# EAGLE design tiny85 (EAGLE 7.1.0)
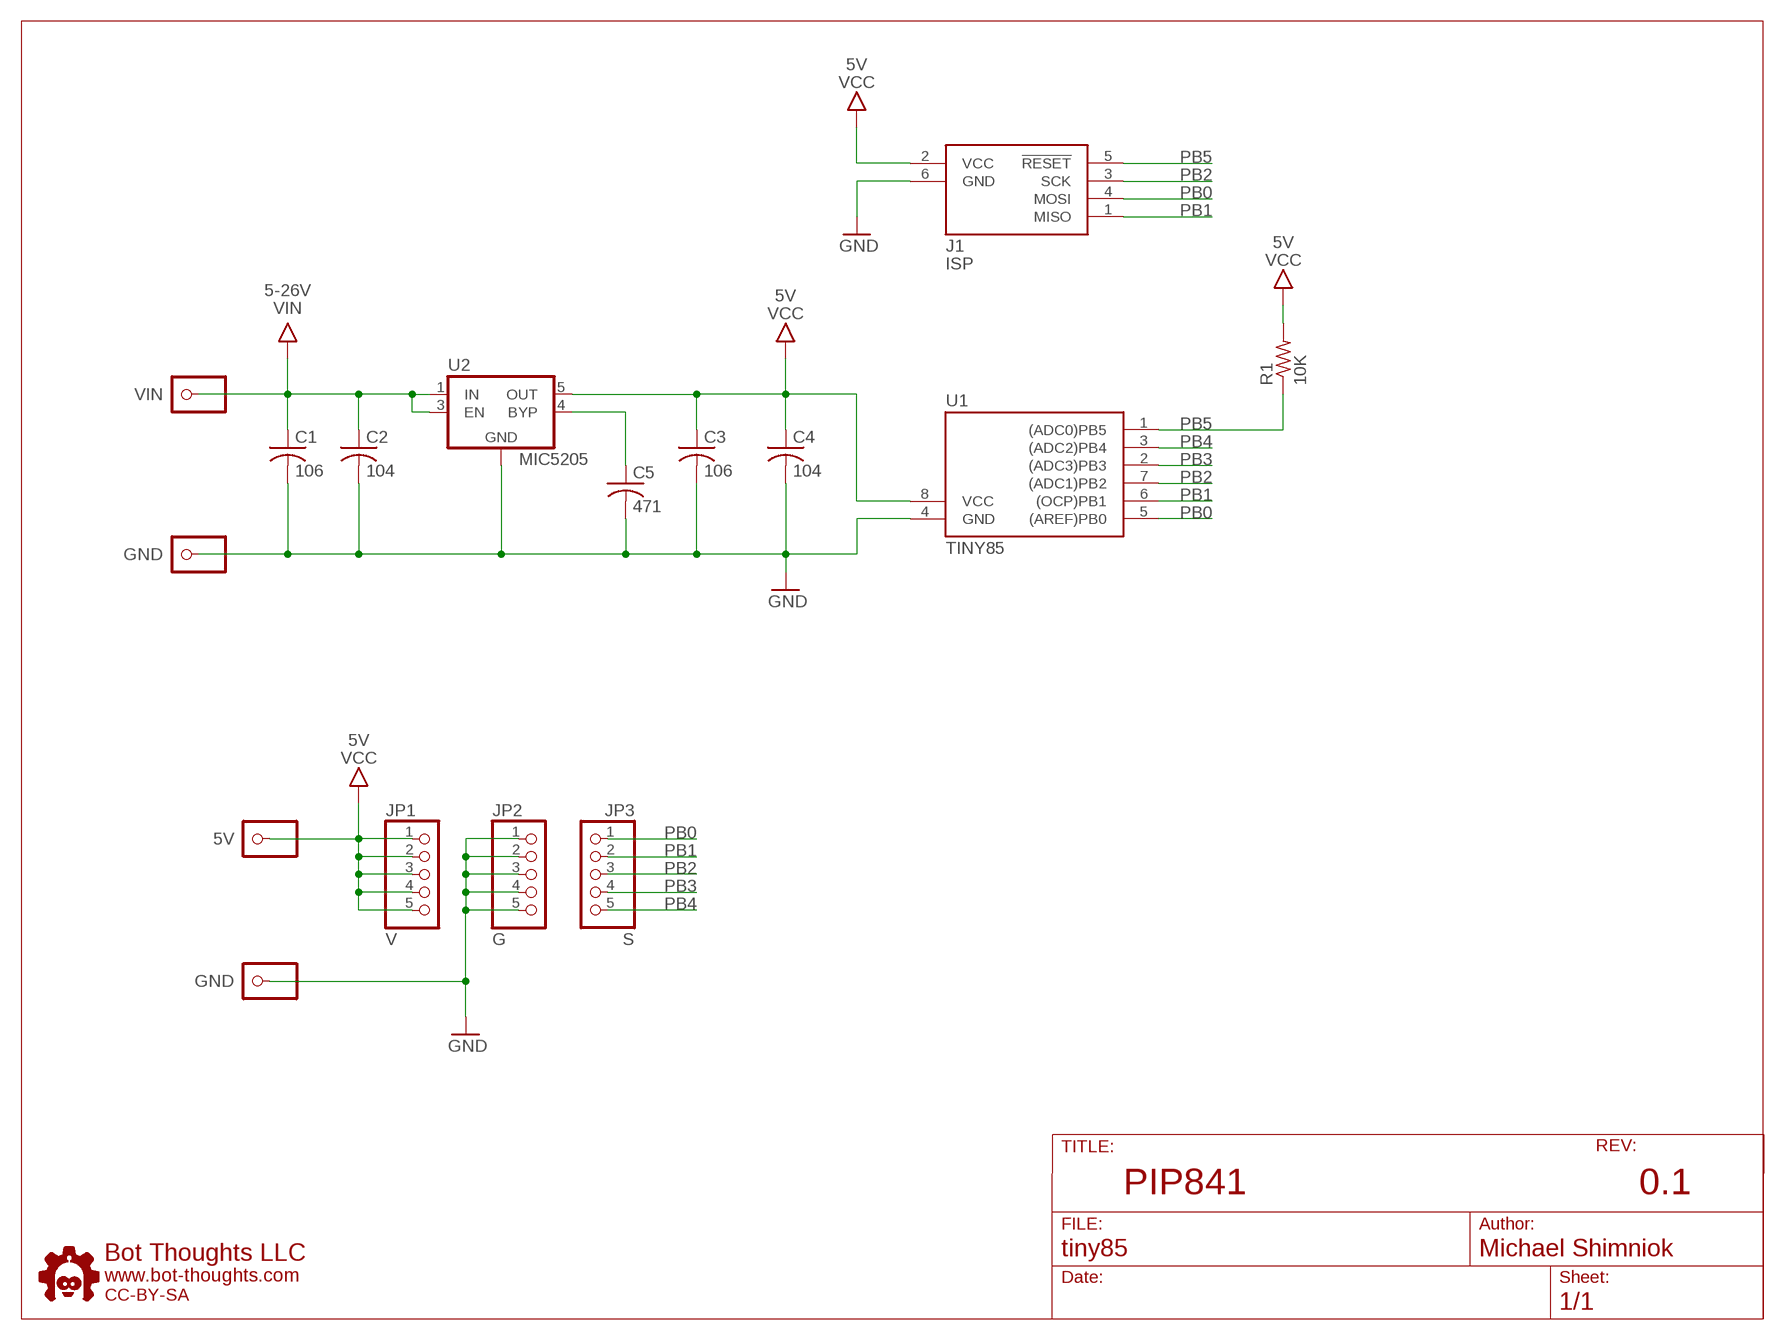
[diagram p0: schematic, sheet 1]

## Parts
C1  106  C-1206  [1206]
C2  104  C-0603  [0603]
C3  106  C-1206  [1206]
C4  104  C-0603  [0603]
C5  471  C-0603  [0603]
J1  ISP  AVRISP6_COMPACT  [CON6P2R]
JP1  V  PINHD-1X05_2.54-S  [1X05-S]
JP2  G  PINHD-1X05_2.54-S  [1X05-S]
JP3  S  PINHD-1X05_2.54-S  [1X05-S]
JP4  GND  PINHD-1X01_2.54  [1X01]
JP5  VIN  PINHD-1X01_2.54  [1X01]
JP6  GND  PINHD-1X01_2.54  [1X01]
JP8  5V  PINHD-1X01_2.54  [1X01]
R1  10K  R0603  [0603]
U1  TINY85  TINY25/45/85-20SU  [SOIC8]
U2  MIC5205  [SOT23-5]
U$3  BTLOGO-LOGO-MD  [BTLOGOM]

## Nets
GND: C1.2(-) C2.2(-) C3.2(-) C4.2(-) C5.2(-) J1.6(GND) JP2.1 JP2.2 JP2.3 JP2.4 JP2.5 JP4.1 JP6.1 U1.4(GND) U2.2(GND)
N$3: C5.1(+) U2.4(BYP)
PB0: J1.4(MOSI) JP3.1 U1.5((AREF)PB0)
PB1: J1.1(MISO) JP3.2 U1.6((OCP)PB1)
PB2: J1.3(SCK) JP3.3 U1.7((ADC1)PB2)
PB3: JP3.4 U1.2((ADC3)PB3)
PB4: JP3.5 U1.3((ADC2)PB4)
PB5: J1.5(!RESET) R1.1 U1.1((ADC0)PB5)
VCC: C3.1(+) C4.1(+) J1.2(VCC) JP1.1 JP1.2 JP1.3 JP1.4 JP1.5 JP8.1 R1.2 U1.8(VCC) U2.5(OUT) ; supply symbol labelled 5V
VIN: C1.1(+) C2.1(+) JP5.1 U2.1(IN) U2.3(EN) ; supply symbol labelled 5-26V

## Notes on the sheet
- PIP841 | 0.1

## Library data of the parts
C1-C5 = bt_rcl:C: Capacitor, non-polarized, American symbol
J1 = bt_avr:AVRISP6: 6-pin dual-row connector for Atmel AVRISP programmer interface
JP1-JP3 = pinhead-2:PINHD-1X05: PIN HEADER
JP4-JP6 JP8 = bt_electromech:PINHD-1X01: PIN HEADER Generic pin header in a variety of footprints
R1 = bt_rcl:R: Resistor, American symbol
U1 = avr-7:TINY25/45/85
U2 = bt_regulator:MIC5205: ULDO Voltage regulator Voltage input: 2.5-16V Guaranteed 150mA output Low dropout voltage: < 350mV @ 150mA, < 70mV @ 50mA High output voltage accuracy (1%) Ultra-low-noise output Low quiescent current Reverse-battery protection “Zero” off-mode current Logic-controlled electronic enable The MIC5205 is an efficient linear voltage regulator with ultra low-noise output, very low dropout voltage (typically 17mV at light loads and 165mV at 150mA), and very low ground current (600⎧A at 100mA output). The MIC5205 offers better than 1% initial accuracy. Designed especially for hand-held, battery-powered devices, the MIC5205 includes a CMOS or TTL compatible enable/shutdown control input. When shut down, power consumption drops nearly to zero. Regulator ground current increases only slightly in dropout, further prolonging battery life. Key MIC5205 features include a reference bypass pin to improve its already excellent low-noise performance, reversed-battery protection, current limiting, and overtemperature shutdown. datasheet.pdf <http://www.micrel.com/_PDF/mic5205.pdf>
U$3 = bt:BTLOGO: Bot Thoughts Logo

## Board
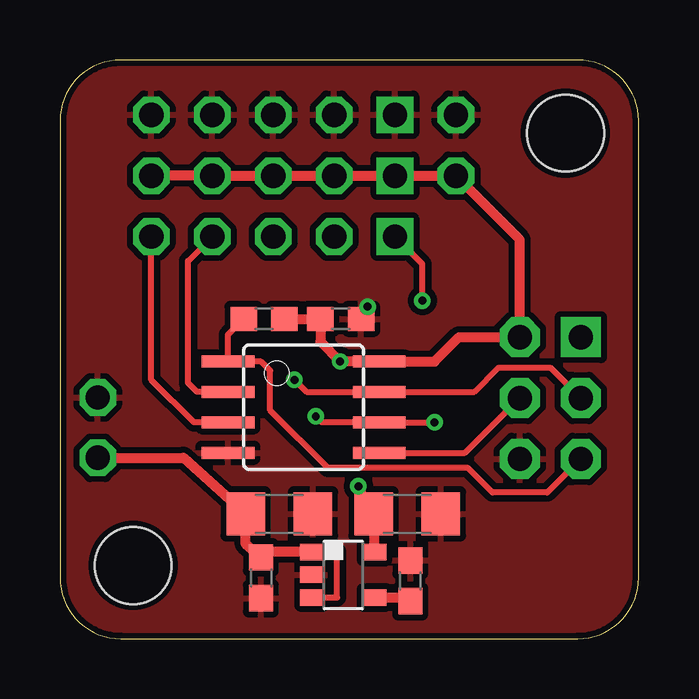
[diagram p1: board, top side]
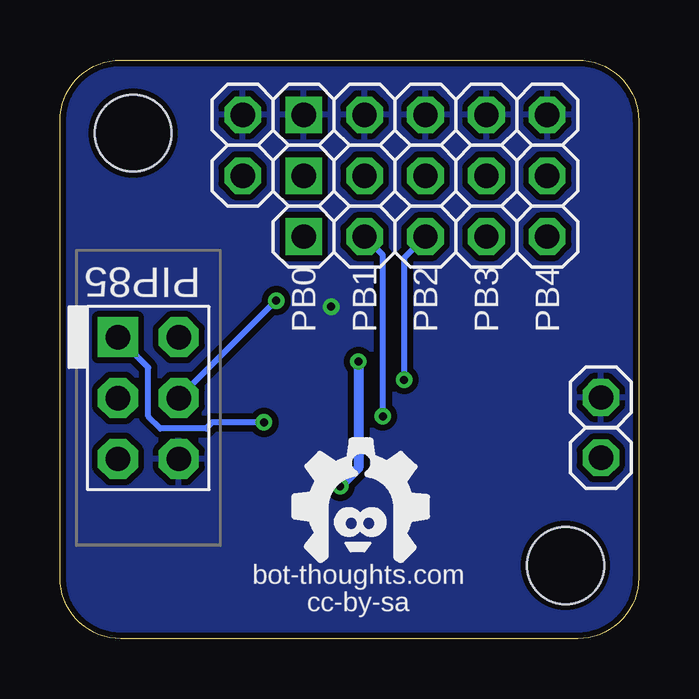
[diagram p2: board, bottom side, seen from below]

Size 24.13 x 24.13 mm. Coordinates in mm from the lower left corner, seen from the top.
Outline: 21.59,24.13 2.54,24.13 arc90 0,21.59 0,2.54 arc90 2.54,0 21.59,0 arc90 24.13,2.54 24.13,21.59 arc90 21.59,24.13
Copper layers (1*16): Top 0.0356mm / dielectric 1.5011mm / Bottom 0.0356mm
Design rules "LaenPCBOrder *": minimum track width 6mil, minimum drill 13mil, track to track 8mil, track to pad 8mil, pad to pad 8mil, via to via 8mil, smd to smd 8mil, copper to edge 10mil, drill to drill 10mil, minimum pad ring 7mil, minimum via ring 7mil, stop-mask expansion 3mil, vias tented up to drill 20mil, thermal gap 10mil
Holes 3.2 mm at 3.05,3.05 21.08,21.08

### Footprints (pad centres in the part's own frame; a part is rotated, then mirrored left to right if it is on the bottom)
1206 = smd 1.6 x 1.8: 1 -1.4,0; 2 1.4,0
0603 = smd 1.1 x 1: 1 -0.85,0; 2 0.85,0
CON6P2R = drill 1.016 pad 1.676 square: 1 -2.54,-1.27 | drill 1.016 pad 1.676 octagon: 2 -2.54,1.27; 3 0,-1.27; 4 0,1.27; 5 2.54,-1.27; 6 2.54,1.27
1X05-S = drill 1.016 square: 1 -5.08,0 | drill 1.016 octagon: 2 -2.54,0; 3 0,0; 4 2.54,0; 5 5.08,0
1X01 = drill 1.016 octagon: 1 0,0
SOIC8 = smd 0.5 x 2.2: 1 -1.905,-3.154; 2 -0.635,-3.154; 3 0.635,-3.154; 4 1.905,-3.154; 5 1.905,3.154; 6 0.635,3.154; 7 -0.635,3.154; 8 -1.905,3.154
SOT23-5 = smd 0.69 x 0.99: 1 -0.95,-1.3; 2 0,-1.3; 3 0.95,-1.3; 4 0.95,1.3; 5 -0.95,1.3

### Placement (x,y rotation side)
C1  9.14,5.21 0 top
C2  8.38,2.54 270 top
C3  14.48,5.21 0 top
C4  11.71,13.34 0 top
C5  14.61,2.41 90 top
J1  20.45,10.03 270 bottom
JP1  8.89,19.3 0 bottom
JP2  8.89,21.84 0 bottom
JP3  8.89,16.76 0 bottom
JP4  16.51,21.84 180 bottom
JP5  1.57,7.54 180 bottom
JP6  1.57,10.06 180 bottom
JP8  16.51,19.3 180 bottom
R1  8.51,13.34 0 top
U1  10.16,9.65 270 top
U2  11.81,2.67 270 top
U$3  11.67,3 0 bottom

### Tracks (layer width: path | path; a pad name or v marks a point on that pad's centre or on a via)
GND  (via drill 0.33)
  other vias: 12.83,13.84
  pour Bottom (isolate 0.254): 24.13,21.59 24.13,2.54 arc-90 21.59,0 2.54,0 arc-90 0,2.54 0,21.59 arc-90 2.54,24.13 21.59,24.13 arc-90
  pour Top (isolate 0.254): 24.13,21.59 24.13,2.54 arc-90 21.59,0 2.54,0 arc-90 0,2.54 0,21.59 arc-90 2.54,24.13 21.59,24.13 arc-90
N$3
  Top 0.406: U2.4 14.23,1.72 arc-45 C5.1
PB0  (via drill 0.33)
  Top 0.254: U1.5 16.89,7.75 J1.4 | v15.11,14.1 15.11,15.62 JP3.1
  Bottom 0.254: J1.4 v15.11,14.1
PB1  (via drill 0.33)
  Top 0.254: v10.67,9.27 10.92,9.02 U1.6 v15.62,9.02
  Bottom 0.254: v10.67,9.27 10.67,16 JP3.2 | v15.62,9.02 17.78,9.02 18.03,8.76 19.94,8.76 20.45,9.27 20.45,11.3 J1.1
PB2  (via drill 0.33)
  Top 0.254: v9.78,10.79 10.29,10.29 U1.7 17.27,10.29 18.29,11.3 20.45,11.3 J1.3
  Bottom 0.254: JP3.3 9.78,15.88 v9.78,10.79
PB3
  Top 0.254: U1.2 5.71,10.29 5.33,10.67 5.33,15.75 JP3.4
PB4
  Top 0.254: U1.3 5.59,9.02 3.81,10.79 JP3.5
PB5
  Top 0.254: R1.1 7.01,12.68 U1.1 8.38,11.56 8.76,11.18 8.76,9.53 11.18,7.11 17.02,7.11 18.03,6.1 20.32,6.1 J1.5
VCC  (via drill 0.33)
  Top 0.406: JP1.5 JP1.4 JP1.3 JP1.2 JP1.1 JP8.1 19.18,16.64 J1.2 16.64,12.57 15.62,11.56 U1.8 v11.68,11.56 10.86,12.38 C4.1 R1.2 | v12.45,6.35 12.83,5.21 C3.1 arc-45 13.11,5.13 U2.5
  Bottom 0.406: v11.68,11.56 11.68,7.11 v12.45,6.35
VIN
  Top 0.254: U2.3 11.56,1.72 11.56,3.62 U2.1
  Top 0.406: JP5.1 5.15,7.54 C1.1 7.75,3.93 C2.1 8.1,3.62 U2.1

### Text on the board
bNames: PB4 | PB3 | PB2 | PB1 | PB0 | PIP85 | bot-thoughts.com | cc-by-sa